# EAGLE design Relaisplatine (EAGLE 4.09)
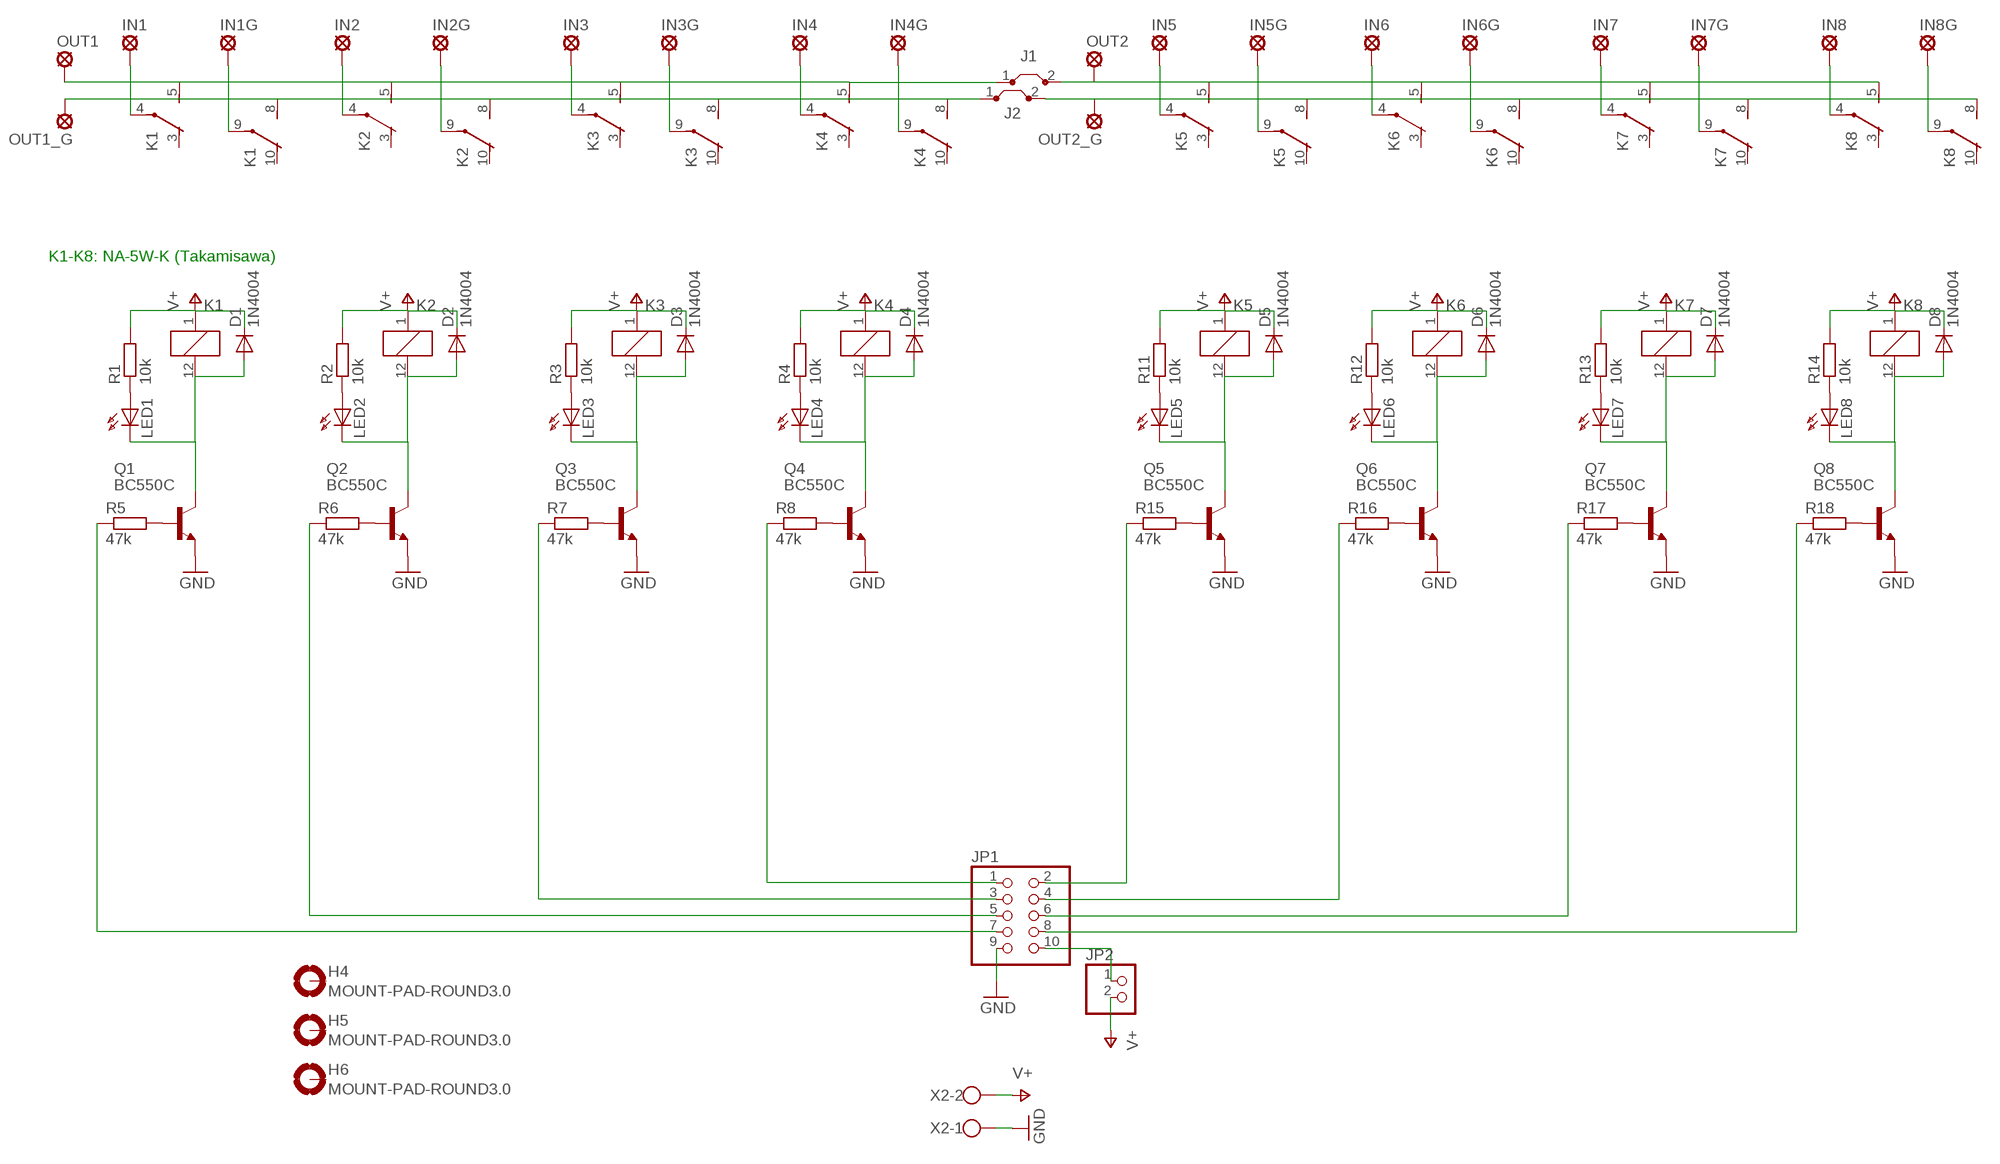
[diagram p0: schematic, sheet 1]

## Parts
D1  1N4004  DIODE-C1702-05  [C1702-05]
D2  1N4004  DIODE-C1702-05  [C1702-05]
D3  1N4004  DIODE-C1702-05  [C1702-05]
D4  1N4004  DIODE-C1702-05  [C1702-05]
D5  1N4004  DIODE-C1702-05  [C1702-05]
D6  1N4004  DIODE-C1702-05  [C1702-05]
D7  1N4004  DIODE-C1702-05  [C1702-05]
D8  1N4004  DIODE-C1702-05  [C1702-05]
H4  MOUNT-PAD-ROUND3.0  [3,0-PAD]
H5  MOUNT-PAD-ROUND3.0  [3,0-PAD]
H6  MOUNT-PAD-ROUND3.0  [3,0-PAD]
IN1  LSP11  [LSP11]
IN1G  LSP11  [LSP11]
IN2  LSP11  [LSP11]
IN2G  LSP11  [LSP11]
IN3  LSP11  [LSP11]
IN3G  LSP11  [LSP11]
IN4  LSP11  [LSP11]
IN4G  LSP11  [LSP11]
IN5  LSP11  [LSP11]
IN5G  LSP11  [LSP11]
IN6  LSP11  [LSP11]
IN6G  LSP11  [LSP11]
IN7  LSP11  [LSP11]
IN7G  LSP11  [LSP11]
IN8  LSP11  [LSP11]
IN8G  LSP11  [LSP11]
J1  J2,5MM  [0,25]
J2  J2,5MM  [0,25]
JP1  PINHD-2X5  [2X05]
JP2  PINHD-1X2  [1X02]
K1  NA  [NA]
K2  NA  [NA]
K3  NA  [NA]
K4  NA  [NA]
K5  NA  [NA]
K6  NA  [NA]
K7  NA  [NA]
K8  NA  [NA]
LED1  LED3MM  [LED3MM]
LED2  LED3MM  [LED3MM]
LED3  LED3MM  [LED3MM]
LED4  LED3MM  [LED3MM]
LED5  LED3MM  [LED3MM]
LED6  LED3MM  [LED3MM]
LED7  LED3MM  [LED3MM]
LED8  LED3MM  [LED3MM]
OUT1  LSP11  [LSP11]
OUT1_G  LSP11  [LSP11]
OUT2  LSP11  [LSP11]
OUT2_G  LSP11  [LSP11]
Q1  BC550C  [TO92-EBC]
Q2  BC550C  [TO92-EBC]
Q3  BC550C  [TO92-EBC]
Q4  BC550C  [TO92-EBC]
Q5  BC550C  [TO92-EBC]
Q6  BC550C  [TO92-EBC]
Q7  BC550C  [TO92-EBC]
Q8  BC550C  [TO92-EBC]
R1  10k  R-EU_0207/2V  [0207/2V]
R2  10k  R-EU_0207/2V  [0207/2V]
R3  10k  R-EU_0207/2V  [0207/2V]
R4  10k  R-EU_0207/2V  [0207/2V]
R5  47k  R-EU_0207/10  [0207/10]
R6  47k  R-EU_0207/10  [0207/10]
R7  47k  R-EU_0207/10  [0207/10]
R8  47k  R-EU_0207/10  [0207/10]
R11  10k  R-EU_0207/2V  [0207/2V]
R12  10k  R-EU_0207/2V  [0207/2V]
R13  10k  R-EU_0207/2V  [0207/2V]
R14  10k  R-EU_0207/2V  [0207/2V]
R15  47k  R-EU_0207/10  [0207/10]
R16  47k  R-EU_0207/10  [0207/10]
R17  47k  R-EU_0207/10  [0207/10]
R18  47k  R-EU_0207/10  [0207/10]
X2  W237-102  [W237-102]

## Nets
GND: JP1.9 Q1.E Q2.E Q3.E Q4.E Q5.E Q6.E Q7.E Q8.E X2.1
N$1: LED1.A R1.1
N$2: LED2.A R2.1
N$3: LED3.A R3.1
N$4: LED4.A R4.1
N$5: D1.A K1.12(1:-) LED1.K(C) Q1.C
N$6: D2.A K2.12(1:-) LED2.K(C) Q2.C
N$7: D3.A K3.12(1:-) LED3.K(C) Q3.C
N$8: D4.A K4.12(1:-) LED4.K(C) Q4.C
N$12: JP1.10 JP2.1
N$13: Q1.B R5.2
N$14: Q2.B R6.2
N$15: Q3.B R7.2
N$16: Q4.B R8.2
N$31: IN1.MP K1.4(2:P)
N$32: IN1G.MP K1.9(3:P)
N$33: IN2.MP K2.4(2:P)
N$34: IN2G.MP K2.9(3:P)
N$35: IN3.MP K3.4(2:P)
N$36: IN3G.MP K3.9(3:P)
N$37: IN4.MP K4.4(2:P)
N$38: IN4G.MP K4.9(3:P)
N$39: J1.1 K1.5(2:S) K2.5(2:S) K3.5(2:S) K4.5(2:S) OUT1.MP
N$40: J2.1 K1.8(3:S) K2.8(3:S) K3.8(3:S) K4.8(3:S) OUT1_G.MP
N$41: LED5.A R11.1
N$42: LED6.A R12.1
N$43: LED7.A R13.1
N$44: LED8.A R14.1
N$45: D5.A K5.12(1:-) LED5.K(C) Q5.C
N$46: D6.A K6.12(1:-) LED6.K(C) Q6.C
N$47: D7.A K7.12(1:-) LED7.K(C) Q7.C
N$48: D8.A K8.12(1:-) LED8.K(C) Q8.C
N$49: Q5.B R15.2
N$50: Q6.B R16.2
N$51: Q7.B R17.2
N$52: Q8.B R18.2
N$57: IN5.MP K5.4(2:P)
N$58: IN5G.MP K5.9(3:P)
N$59: IN6.MP K6.4(2:P)
N$60: IN6G.MP K6.9(3:P)
N$61: IN7.MP K7.4(2:P)
N$62: IN7G.MP K7.9(3:P)
N$63: IN8.MP K8.4(2:P)
N$64: IN8G.MP K8.9(3:P)
N$65: J1.2 K5.5(2:S) K6.5(2:S) K7.5(2:S) K8.5(2:S) OUT2.MP
N$66: J2.2 K5.8(3:S) K6.8(3:S) K7.8(3:S) K8.8(3:S) OUT2_G.MP
RELAYS1: JP1.7 R5.1
RELAYS2: JP1.5 R6.1
RELAYS3: JP1.3 R7.1
RELAYS4: JP1.1 R8.1
RELAYS5: JP1.2 R15.1
RELAYS6: JP1.4 R16.1
RELAYS7: JP1.6 R17.1
RELAYS8: JP1.8 R18.1
V+: D1.C D2.C D3.C D4.C D5.C D6.C D7.C D8.C JP2.2 K1.1(1:+) K2.1(1:+) K3.1(1:+) K4.1(1:+) K5.1(1:+) K6.1(1:+) K7.1(1:+) K8.1(1:+) R1.2 R2.2 R3.2 R4.2 R11.2 R12.2 R13.2 R14.2 X2.2
Unconnected: H4.B3,0(MOUNT) H5.B3,0(MOUNT) H6.B3,0(MOUNT) K1.3(2:O) K1.10(3:O) K2.3(2:O) K2.10(3:O) K3.3(2:O) K3.10(3:O) K4.3(2:O) K4.10(3:O) K5.3(2:O) K5.10(3:O) K6.3(2:O) K6.10(3:O) K7.3(2:O) K7.10(3:O) K8.3(2:O) K8.10(3:O)

## Notes on the sheet
- K1-K8: NA-5W-K (Takamisawa)

## Library data of the parts
D1-D8 = diode:DIODE-: DIODE
H4-H6 = holes:MOUNT-PAD-ROUND: MOUNTING PAD, round
IN1 IN1G IN2 IN2G IN3 IN3G IN4 IN4G IN5 IN5G IN6 IN6G IN7 IN7G IN8 IN8G OUT1 OUT1_G OUT2 OUT2_G = solpad:LSP11: SOLDER PAD drill 1.1 mm
J1 J2 = ben:J
JP1 = pinhead:PINHD-2X5: PIN HEADER
JP2 = pinhead:PINHD-1X2: PIN HEADER
K1-K8 = relay:NA: RELAY
LED1-LED8 = led:LED: LED
Q1-Q8 = transistor-npn:BC550*: NPN Transistor
R1-R8 R11-R18 = rcl:R-EU_: RESISTOR, European symbol
X2 = con-wago-500:W237-102: WAGO SCREW CLAMP

## Board
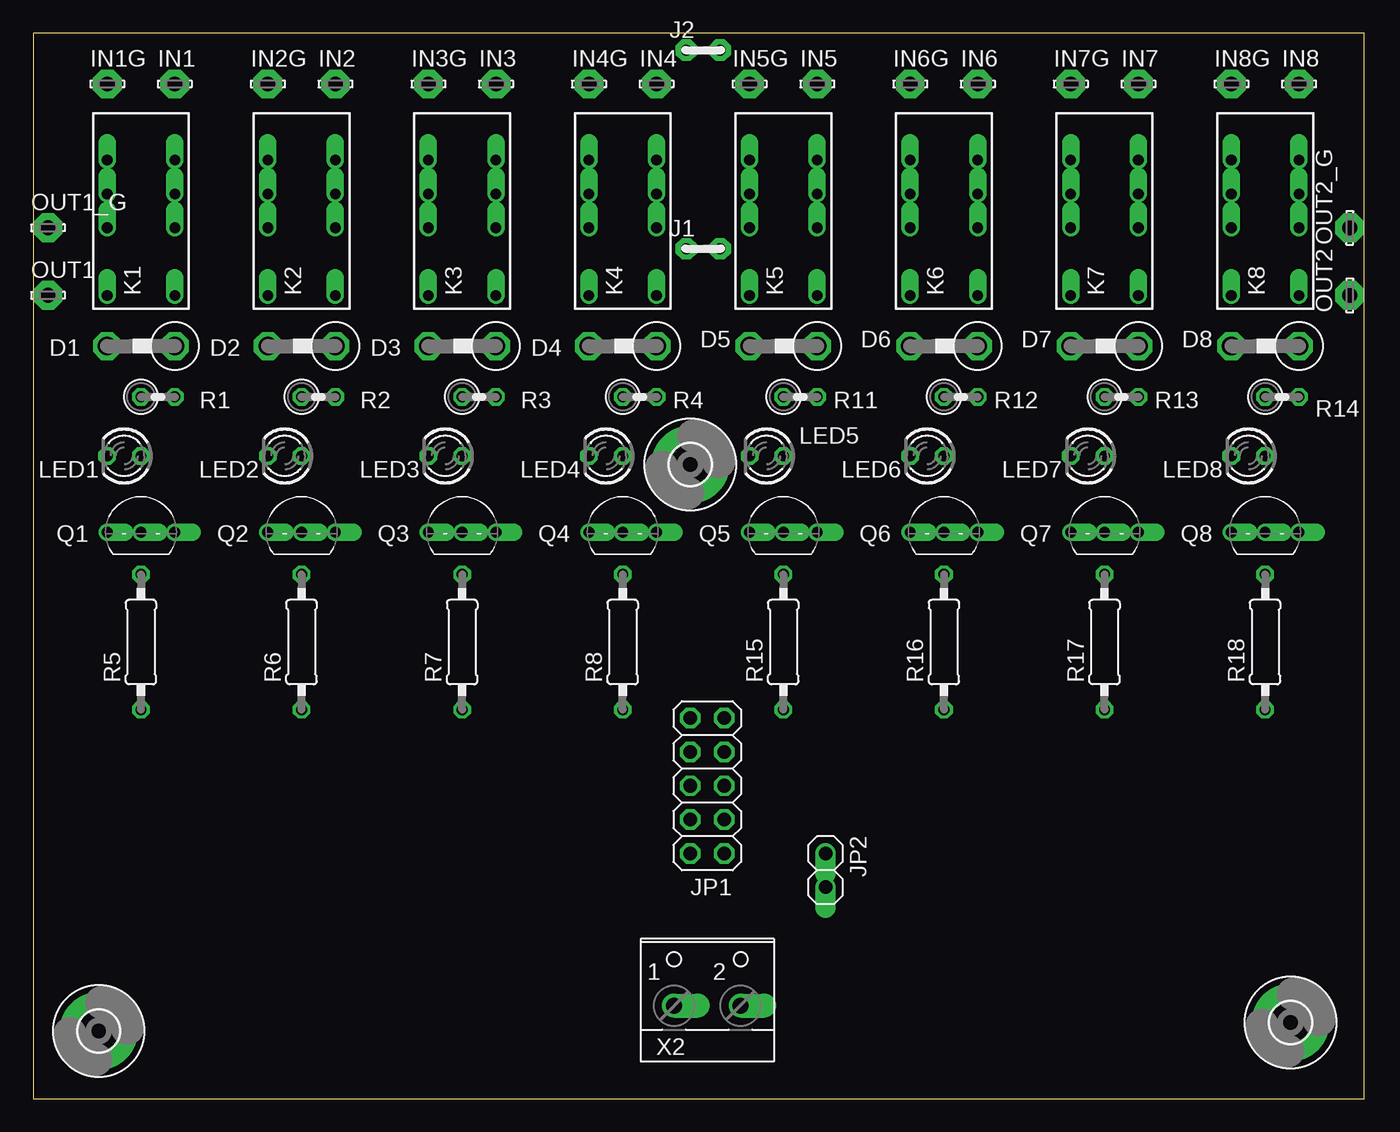
[diagram p1: board, top side]
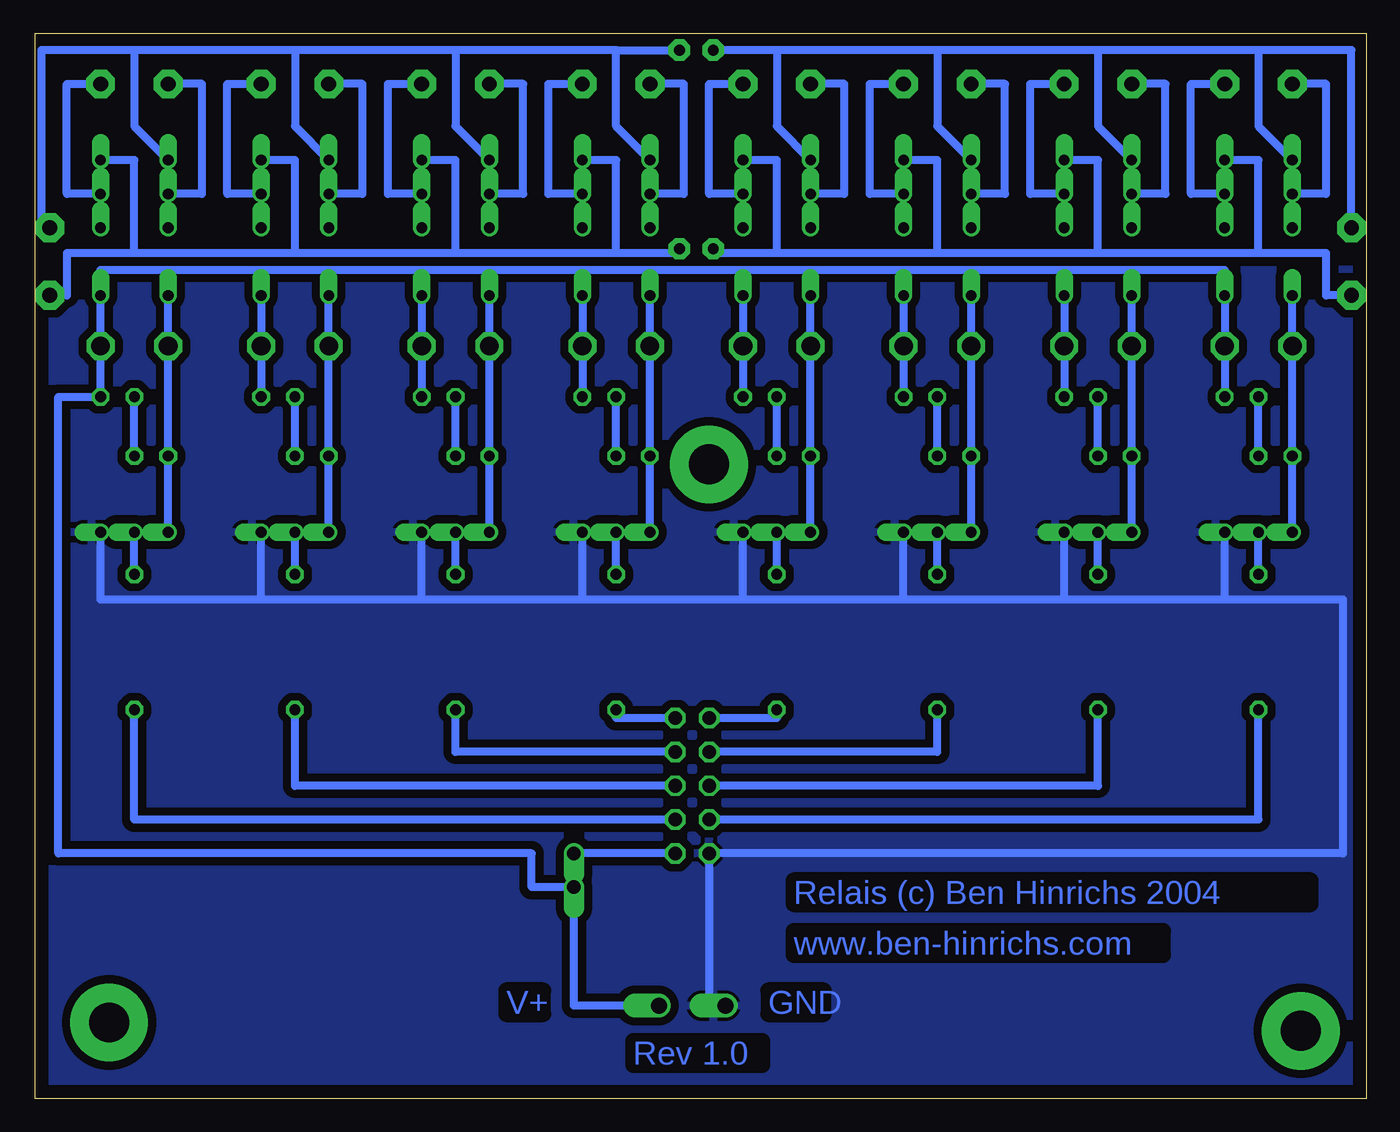
[diagram p2: board, bottom side, seen from below]

Size 100 x 80 mm. Coordinates in mm from the lower left corner, seen from the top.
Outline: 0,0 100,0 100,80 0,80 0,0
Copper layers used: Bottom

### Footprints (pad centres in the part's own frame; a part is rotated, then mirrored left to right if it is on the bottom)
C1702-05 = drill 1.397 octagon: A 2.54,0; C -2.54,0
3,0-PAD = drill 3 pad 5.842 round: B3,0 0,0
LSP11 = drill 1.118 pad 2.159 octagon: MP 0,0
0,25 = drill 0.813 pad 1.6 octagon: 1 -1.27,0; 2 1.27,0
2X05 = drill 1.016 octagon: 1 -5.08,-1.27; 2 -5.08,1.27; 3 -2.54,-1.27; 4 -2.54,1.27; 5 0,-1.27; 6 0,1.27; 7 2.54,-1.27; 8 2.54,1.27; 9 5.08,-1.27; 10 5.08,1.27
1X02 = drill 1.016 offset: 1 -1.27,0; 2 1.27,0
NA = drill 0.8 offset: 1 -6.35,-2.54; 3 -1.27,-2.54; 4 1.27,-2.54; 5 3.81,-2.54; 8 3.81,2.54; 9 1.27,2.54; 10 -1.27,2.54; 12 -6.35,2.54
LED3MM = drill 0.813 octagon: A -1.27,0; K 1.27,0
TO92-EBC = drill 0.813 offset: B 0,-1.27; C -2.54,-1.27; E 2.54,-1.27
0207/2V = drill 0.813 octagon: 1 -1.27,0; 2 1.27,0
0207/10 = drill 0.813 octagon: 1 -5.08,0; 2 5.08,0
W237-102 = drill 1.194 offset: 1 -2.5,-1.27; 2 2.5,-1.27

### Placement (x,y rotation side)
D1  8.09,56.51 180 top
D2  20.15,56.51 180 top
D3  32.22,56.51 180 top
D4  44.28,56.51 180 top
D5  56.35,56.51 180 top
D6  68.41,56.51 180 top
D7  80.48,56.51 180 top
D8  92.55,56.51 180 top
H4  4.92,5.08 0 top
H5  94.45,5.71 0 top
H6  49.37,47.62 0 top
IN1  10.63,76.19 0 top
IN1G  5.55,76.19 0 top
IN2  22.7,76.19 0 top
IN2G  17.61,76.19 0 top
IN3  34.76,76.19 0 top
IN3G  29.68,76.19 0 top
IN4  46.82,76.19 0 top
IN4G  41.74,76.19 0 top
IN5  58.89,76.19 0 top
IN5G  53.81,76.19 0 top
IN6  70.95,76.19 0 top
IN6G  65.88,76.19 0 top
IN7  83.02,76.19 0 top
IN7G  77.94,76.19 0 top
IN8  95.08,76.19 0 top
IN8G  90,76.19 0 top
J1  50.33,63.83 0 top
J2  50.33,78.73 0 top
JP1  50.63,23.49 270 top
JP2  59.52,17.14 270 top
K1  8.09,66.67 90 top
K2  20.15,66.67 90 top
K3  32.22,66.67 90 top
K4  44.28,66.67 90 top
K5  56.35,66.67 90 top
K6  68.41,66.67 90 top
K7  80.48,66.67 90 top
K8  92.55,66.67 90 top
LED1  6.82,48.26 180 top
LED2  18.88,48.26 180 top
LED3  30.95,48.26 180 top
LED4  43.02,48.26 180 top
LED5  55.08,48.26 180 top
LED6  67.14,48.26 180 top
LED7  79.21,48.26 180 top
LED8  91.28,48.26 180 top
OUT1  1.1,60.32 0 top
OUT1_G  1.1,65.4 0 top
OUT2  98.89,60.32 90 top
OUT2_G  98.89,65.4 90 top
Q1  8.09,43.81 0 top
Q2  20.15,43.81 0 top
Q3  32.22,43.81 0 top
Q4  44.28,43.81 0 top
Q5  56.35,43.81 0 top
Q6  68.41,43.81 0 top
Q7  80.48,43.81 0 top
Q8  92.55,43.81 0 top
R1  9.36,52.7 0 top
R2  21.42,52.7 0 top
R3  33.49,52.7 0 top
R4  45.55,52.7 0 top
R5  8.09,34.29 90 top
R6  20.15,34.29 90 top
R7  32.22,34.29 90 top
R8  44.28,34.29 90 top
R11  57.62,52.7 0 top
R12  69.69,52.7 0 top
R13  81.75,52.7 0 top
R14  93.81,52.7 0 top
R15  56.35,34.29 90 top
R16  68.41,34.29 90 top
R17  80.48,34.29 90 top
R18  92.55,34.29 90 top
X2  50.63,8.25 0 top

### Tracks (layer width: path | path; a pad name or v marks a point on that pad's centre or on a via)
GND
  Bottom 0.61: 10.63,37.46 Q1.E | 10.63,37.46 22.7,37.46 | 22.7,37.46 Q2.E | 22.7,37.46 34.76,37.46 | 34.76,37.46 Q3.E | 46.82,37.46 Q4.E | 34.76,37.46 46.82,37.46 | 58.89,37.46 Q5.E | 46.82,37.46 58.89,37.46 | 70.95,37.46 Q6.E | 58.89,37.46 70.95,37.46 | 83.02,37.46 Q7.E | 70.95,37.46 83.02,37.46 | Q8.E 95.08,37.46 83.02,37.46 | 10.63,37.46 1.74,37.46 1.74,18.41 JP1.9 49.37,6.98 X2.1
  pour Bottom (isolate 0.61): 0.47,62.23 99.53,62.23 99.53,0.63 0.47,0.63
N$1
  Bottom 0.61: LED1.A R1.1
N$2
  Bottom 0.61: LED2.A R2.1
N$3
  Bottom 0.61: LED3.A R3.1
N$4
  Bottom 0.61: LED4.A R4.1
N$5
  Bottom 0.61: K1.12 D1.A LED1.K Q1.C
N$6
  Bottom 0.61: Q2.C LED2.K D2.A K2.12
N$7
  Bottom 0.61: Q3.C LED3.K D3.A K3.12
N$8
  Bottom 0.61: Q4.C LED4.K D4.A K4.12
N$12
  Bottom 0.61: JP1.10 JP2.1
N$13
  Bottom 0.61: R5.2 Q1.B
N$14
  Bottom 0.61: R6.2 Q2.B
N$15
  Bottom 0.61: R7.2 Q3.B
N$16
  Bottom 0.61: R8.2 Q4.B
N$31
  Bottom 0.61: K1.4 13.17,67.94 13.17,76.19 IN1.MP
N$32
  Bottom 0.61: IN1G.MP 3.01,76.19 3.01,67.94 K1.9
N$33
  Bottom 0.61: K2.4 25.23,67.94 25.23,76.19 IN2.MP
N$34
  Bottom 0.61: IN2G.MP 15.08,76.19 15.08,67.94 K2.9
N$35
  Bottom 0.61: K3.4 37.3,67.94 37.3,76.19 IN3.MP
N$36
  Bottom 0.61: IN3G.MP 27.14,76.19 27.14,67.94 K3.9
N$37
  Bottom 0.61: K4.4 49.37,67.94 49.37,76.19 IN4.MP
N$38
  Bottom 0.61: IN4G.MP 39.2,76.19 39.2,67.94 K4.9
N$39
  Bottom 0.61: K1.5 8.09,70.48 8.09,63.5 | K2.5 20.15,70.48 20.15,63.5 | 8.09,63.5 20.15,63.5 | K3.5 32.22,70.48 32.22,63.5 | 20.15,63.5 32.22,63.5 | K4.5 44.28,70.48 44.28,63.5 | 32.22,63.5 44.28,63.5 | 8.09,63.5 3.01,63.5 3.01,60.32 OUT1.MP | 44.28,63.5 49.06,63.5 J1.1
N$40
  Bottom 0.61: 8.09,78.73 20.15,78.73 | 20.15,78.73 32.22,78.73 | K1.8 8.09,73.02 8.09,78.73 | K2.8 20.15,73.02 20.15,78.73 | K3.8 32.22,73.02 32.22,78.73 | K4.8 44.28,73.02 44.28,78.73 | 8.09,78.73 1.1,78.73 OUT1_G.MP | 32.22,78.73 44.28,78.73 | 44.28,78.73 J2.1
N$41
  Bottom 0.61: LED5.A R11.1
N$42
  Bottom 0.61: LED6.A R12.1
N$43
  Bottom 0.61: LED7.A R13.1
N$44
  Bottom 0.61: LED8.A R14.1
N$45
  Bottom 0.61: K5.12 D5.A LED5.K Q5.C
N$46
  Bottom 0.61: K6.12 D6.A LED6.K Q6.C
N$47
  Bottom 0.61: K7.12 D7.A LED7.K Q7.C
N$48
  Bottom 0.61: K8.12 D8.A LED8.K Q8.C
N$49
  Bottom 0.61: R15.2 Q5.B
N$50
  Bottom 0.61: R16.2 Q6.B
N$51
  Bottom 0.61: R17.2 Q7.B
N$52
  Bottom 0.61: R18.2 Q8.B
N$57
  Bottom 0.61: K5.4 61.43,67.94 61.43,76.19 IN5.MP
N$58
  Bottom 0.61: K5.9 51.27,67.94 51.27,76.19 IN5G.MP
N$59
  Bottom 0.61: K6.4 73.5,67.94 73.5,76.19 IN6.MP
N$60
  Bottom 0.61: K6.9 63.34,67.94 63.34,76.19 IN6G.MP
N$61
  Bottom 0.61: K7.4 85.56,67.94 85.56,76.19 IN7.MP
N$62
  Bottom 0.61: K7.9 75.4,67.94 75.4,76.19 IN7G.MP
N$63
  Bottom 0.61: K8.4 97.62,67.94 97.62,76.19 IN8.MP
N$64
  Bottom 0.61: K8.9 87.47,67.94 87.47,76.19 IN8G.MP
N$65
  Bottom 0.61: K5.5 56.35,70.48 56.35,63.5 | 56.35,63.5 68.41,63.5 | 68.41,63.5 80.48,63.5 | 80.48,63.5 92.55,63.5 | 92.55,63.5 97.62,63.5 97.62,60.32 OUT2.MP | K6.5 68.41,70.48 68.41,63.5 | K7.5 80.48,70.48 80.48,63.5 | K8.5 92.55,70.48 92.55,63.5 | J1.2 51.6,63.5 56.35,63.5
N$66
  Bottom 0.61: K5.8 56.35,73.02 56.35,78.73 | 56.35,78.73 68.41,78.73 | 68.41,78.73 80.48,78.73 | K6.8 68.41,73.02 68.41,78.73 | K7.8 80.48,73.02 80.48,78.73 | K8.8 92.55,73.02 92.55,78.73 | 80.48,78.73 92.55,78.73 | 92.55,78.73 99.53,78.73 99.53,65.4 OUT2_G.MP | 56.35,78.73 J2.2
RELAYS1
  Bottom 0.61: JP1.7 8.09,20.95 R5.1
RELAYS2
  Bottom 0.61: JP1.5 20.15,23.49 R6.1
RELAYS3
  Bottom 0.61: JP1.3 32.22,26.03 R7.1
RELAYS4
  Bottom 0.61: JP1.1 44.28,28.57 R8.1
RELAYS5
  Bottom 0.61: JP1.2 56.35,28.57 R15.1
RELAYS6
  Bottom 0.61: JP1.4 68.41,26.03 R16.1
RELAYS7
  Bottom 0.61: JP1.6 80.48,23.49 R17.1
RELAYS8
  Bottom 0.61: JP1.8 92.55,20.95 R18.1
V+
  Bottom 0.61: 22.7,62.23 K2.1 D2.C R2.2 | 22.7,62.23 10.63,62.23 K1.1 D1.C R1.2 | 34.76,62.23 K3.1 D3.C R3.2 | 34.76,62.23 22.7,62.23 | 46.82,62.23 K4.1 D4.C R4.2 | 46.82,62.23 34.76,62.23 | 58.89,62.23 K5.1 D5.C R11.2 | 58.89,62.23 46.82,62.23 | R12.2 D6.C K6.1 70.95,62.23 | 70.95,62.23 58.89,62.23 | R13.2 D7.C K7.1 83.02,62.23 | 83.02,62.23 70.95,62.23 | 83.02,62.23 95.08,62.23 K8.1 D8.C R14.2 98.26,52.7 98.26,18.41 62.7,18.41 62.7,15.87 JP2.2 59.52,6.98 X2.2

### Text on the board
Bottom: Relais (c) Ben Hinrichs 2004 | www.ben-hinrichs.com | GND | V+ | Rev 1.0